# Altium schematic sheet canbus.SchDoc
size A4; SheetNumber: 1; SheetTotal: 3
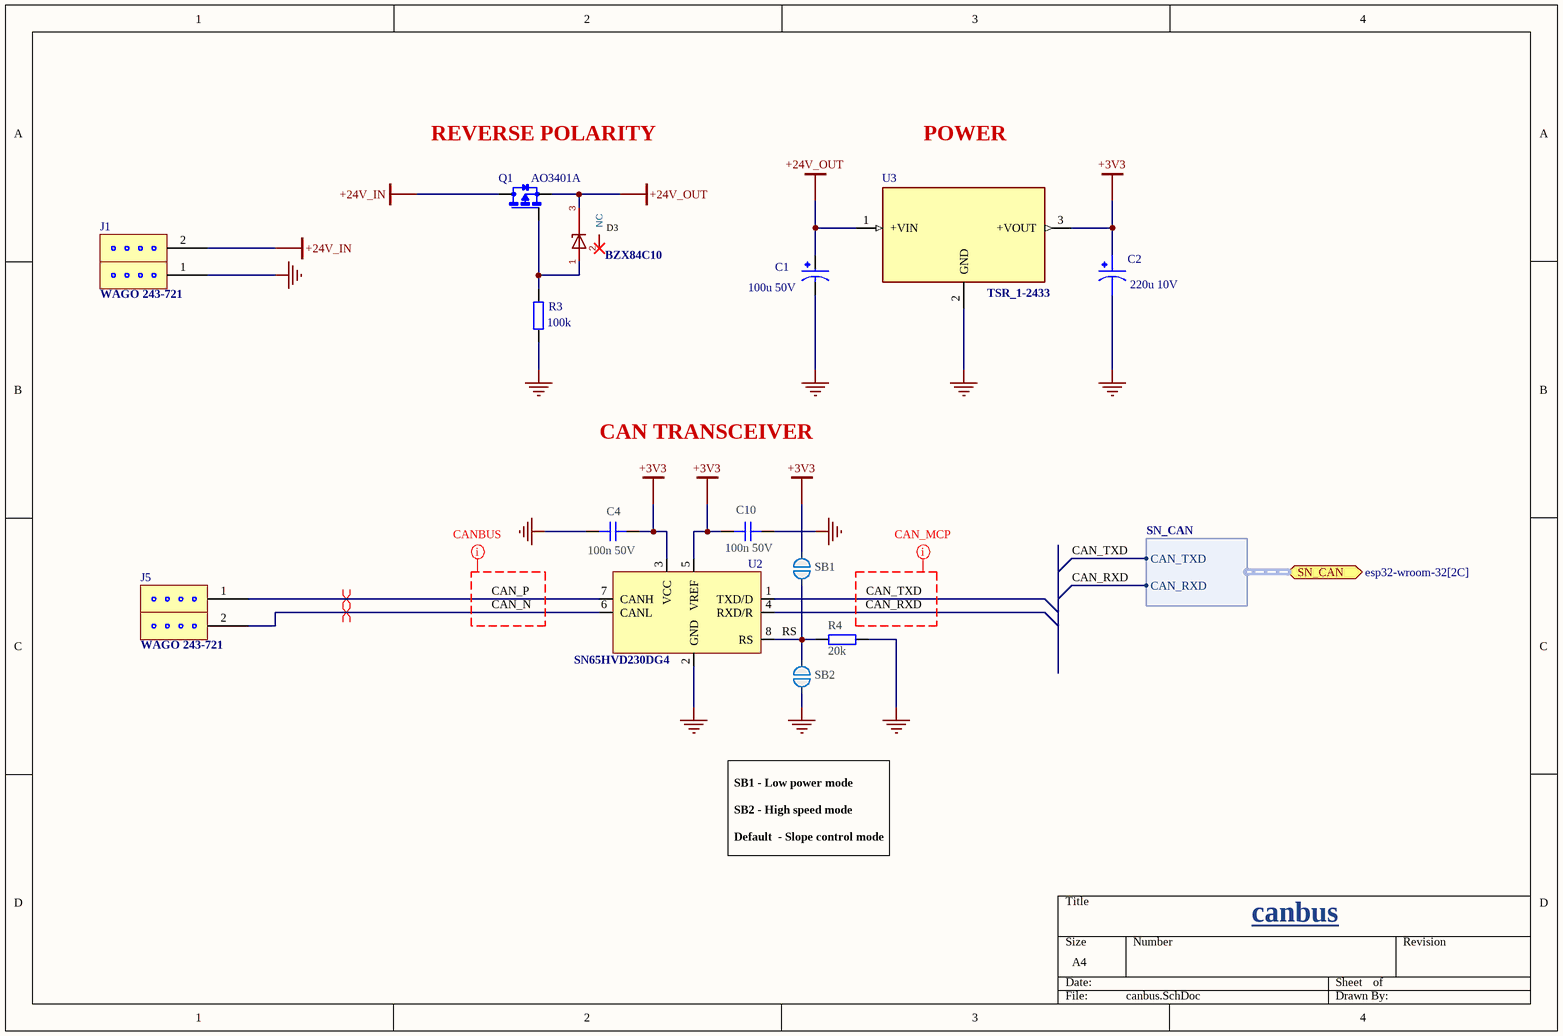
[diagram p0: canbus.SchDoc]

## Parts
C1  100u 50V  [CAPPRD500W60D800H1150]
C2  220u 10V  [CAPPM7343X310N]
C4  100n 50V  [CAPC1005X04L]
C10  100n 50V  [CAPC1005X04L]
D3  BZX84C10  [SOT-23]
J1  WAGO 243-721  [243-721]
J5  WAGO 243-721  [243-721]
Q1  AO3401A  [SOT23]
R3  100k  [RES_0603]
R4  20k  [RESC1005X04L]
SB1  Solderbridge  [Solderbridge]  (value not drawn)  (no BOM)
SB2  Solderbridge  [Solderbridge]  (value not drawn)  (no BOM)
U2  SN65HVD230DG4  [SOIC127P599X175-8N]
U3  TSR_1-2433  [TSR-1]

## Ports
SN_CAN (bidir, harness SN_CAN, see esp32-wroom-32[2C])

## Harnesses
SN_CAN: CAN_TXD, CAN_RXD

## Nets
+3V3: C2.1 C4.2 C10.1 SB1.1 U2.3(VCC) U2.5(VREF) U3.3(+VOUT)
+24V_IN: J1.2 Q1.3(D)
+24V_OUT: C1.P D3.3(C) Q1.2(S) U3.1(+VIN)
GND: C1.N C2.2 C4.1 C10.2 J1.1 R3.1 R4.2 SB2.2 U2.2(GND) U3.2(GND)
CAN_N: J5.2 U2.6(CANL)
CAN_P: J5.1 U2.7(CANH)
CAN_RXD: U2.4(RXD/R) ; port SN_CAN.CAN_RXD
CAN_TXD: U2.1(TXD/D) ; port SN_CAN.CAN_TXD
RS: R4.1 SB1.2 SB2.1 U2.8(RS)
NetD3_1: D3.1(A) Q1.1(G) R3.2

Not connected (* = marked no-connect by the designer): D3 2(NC)*

## Layout directives
net class CAN_UART: CAN_RXD, CAN_TXD
net class CANBUS: CAN_N, CAN_P
differential pair: CAN_N, CAN_P

## Notes on the sheet
- REVERSE POLARITY
- POWER
- CAN TRANSCEIVER
- SB1 - Low power mode
  SB2 - High speed mode
  Default  - Slope control mode
- canbus

## Library data of the parts
C1 = ECA1HHG101B: 100F 50V Aluminum Electrolytic Capacitors Radial, Can 1000 Hrs @ 105C; MP: ECA-1HHG101B; MF: Panasonic Electronic; SnapEDA_Link: https://www.snapeda.com/parts/ECA-1HHG101B/Panasonic%20Electronic%20Components/view-part/800817/?ref=snap; Availability: In Stock; Value: *; Price: None; Package: RADIAL-2 Panasonic; Check_prices: https://www.snapeda.com/parts/ECA-1HHG101B/Panasonic%20Electronic%20Components/view-part/800817/?ref=eda
C2 = TPSD227M010R0050: 220 ÂµF Molded Tantalum Capacitors 10 V 2917 (7343 Metric) 50mOhm; MF: AVX; SnapEDA_Link: https://www.snapeda.com/parts/TPSD227M010R0050/AVX/view-part/?ref=snap; Package: 2917 AVX; Value: *; MP: TPSD227M010R0050; Check_prices: https://www.snapeda.com/parts/TPSD227M010R0050/AVX/view-part/?ref=eda
C4 C10 = C0402-4µ7: Capacitor, X5R, ±20%; Manufacturer: N.A.; Part number IPS: 00000001251, 00000007165; Part number NEMS: 100200193; Value: 4.7µF; Note: 10V; Artikkelnr Noca: 20039482; Pad Count: 2; Component Status: Active; Part Number: C0402-4µ7; Manufacturer Part Number: N.A.; ComponentLink1URL: N.A.; ComponentLink1Description: Datasheet; ComponentLink2URL: N.A.; ComponentLink2Description: Supplier link; HelpURL: N.A.; Footprint Doc: 0402; LatestRevisionDate: 2017-11-09; Published: 2009-05-08; Supplier 1: Digi-Key; Supplier Part Number 1: 490-13252-1-ND; Supplier 2: N.A.; Supplier Part Number 2: N.A.; PartId: 100200193; Component Class: Capacitors; Author: rsk; Part number Norautron: N.A.
D3 = BZX84C10: ki_keywords: Zener Dual Diode Common Anode; ki_description: Zener Dual Diode Common Anode
J1 J5 = 243-721: TERM BLOCK PLUG 1POS 5.75MM
Q1 = AO3401A: P-Channel 30 V 4A (Ta) 1.4W (Ta) Surface Mount SOT-23-3; MF: Alpha & Omega Semiconductor; SnapEDA_Link: https://www.snapeda.com/parts/AO3401A/Alpha/view-part/?ref=snap; Package: SOT-23 Alpha &amp; Omega Semiconductor; Value: *; MP: AO3401A; Check_prices: https://www.snapeda.com/parts/AO3401A/Alpha/view-part/?ref=eda
R3 = RES_0603: Resistor SMD 0603; Manufacturer: *; Manufacturer Part Number: *; Distributor Link: *; LCSC: *
R4 = R0402-0R: Resistor, ±5%, 0.063W; Manufacturer: N.A.; Part number IPS: 00000007128; Part number NEMS: 100100109; Value: 0R; Note: Chip Res 5%; Artikkelnr Noca: 27049000; Pad Count: 2; Component Status: Active; Part Number: R0402-0R; Manufacturer Part Number: N.A.; ComponentLink1URL: N.A.; ComponentLink1Description: Datasheet; ComponentLink2URL: N.A.; ComponentLink2Description: Supplier link; HelpURL: N.A.; Footprint Doc: 0402; LatestRevisionDate: 2009-11-23; Published: 2009-05-08; Supplier 1: Farnell; Supplier Part Number 1: 146-9661; Supplier 2: N.A.; Supplier Part Number 2: N.A.; PartId: 100100109; Component Class: Resistors; Author: rsk; Part number Norautron: N.A.
SB1 SB2 = Solderbridge: Manufacturer: N.A.; Part number NEMS: 100500458; Pad Count: 2; Component Status: Active; System: Connector; Part Number: Solderbridge; Manufacturer Part Number: N.A.; LatestRevisionDate: 2009-12-14; Published: 2009-12-14; Value: Solderbridge; Note: N.A.; Artikkelnr Noca: N.A.; Footprint Doc: Solderbridge; Part number IPS: N.A.; ComponentLink1URL: N.A.; ComponentLink1Description: Datasheet; ComponentLink2URL: N.A.; ComponentLink2Description: Supplier link; HelpURL: N.A.; Supplier 1: N.A.; Supplier Part Number 1: N.A.; Supplier 2: N.A.; Supplier Part Number 2: N.A.; PartId: 100500458; Component Class: Connectors; Author: rsk; Part number Norautron: N.A.
U2 = SN65HVD230DG4: 3.3 V CAN Transceiver with Standby Mode 8-SOIC -40 to 85; MF: Texas Instruments; SnapEDA_Link: https://www.snapeda.com/parts/SN65HVD230DG4/Texas+Instruments/view-part/?ref=snap; Package: SOIC-8 Texas Instruments; Value: *; MP: SN65HVD230DG4; Check_prices: https://www.snapeda.com/parts/SN65HVD230DG4/Texas+Instruments/view-part/?ref=eda
U3 = TSR_1-2433: 1 Amp POL switching regulator, 4.6 to -36 VDC input, pos.-pos. circuit, LM78 compatible, SIP-3; MP: TSR 1-2433; MF: Traco Power; Purchase-URL: https://pricing.snapeda.com/search/part/TSR 1-2433/?ref=eda; Package: SIP-3 Traco Power; Availability: In Stock; Value: *; Price: None; SnapEDA_Link: https://www.snapeda.com/parts/TSR%201-2433/Traco%20Power/view-part/6027450/?ref=snap; Check_prices: https://www.snapeda.com/parts/TSR%201-2433/Traco%20Power/view-part/6027450/?ref=eda